# EAGLE design v0.1 (EAGLE 9.2.0)
CNAME: CarIas; CREVISION: C; DESIGNER: OML

## Sheet 1 of 4: MAX31588 thermocouple amp. 7 channels
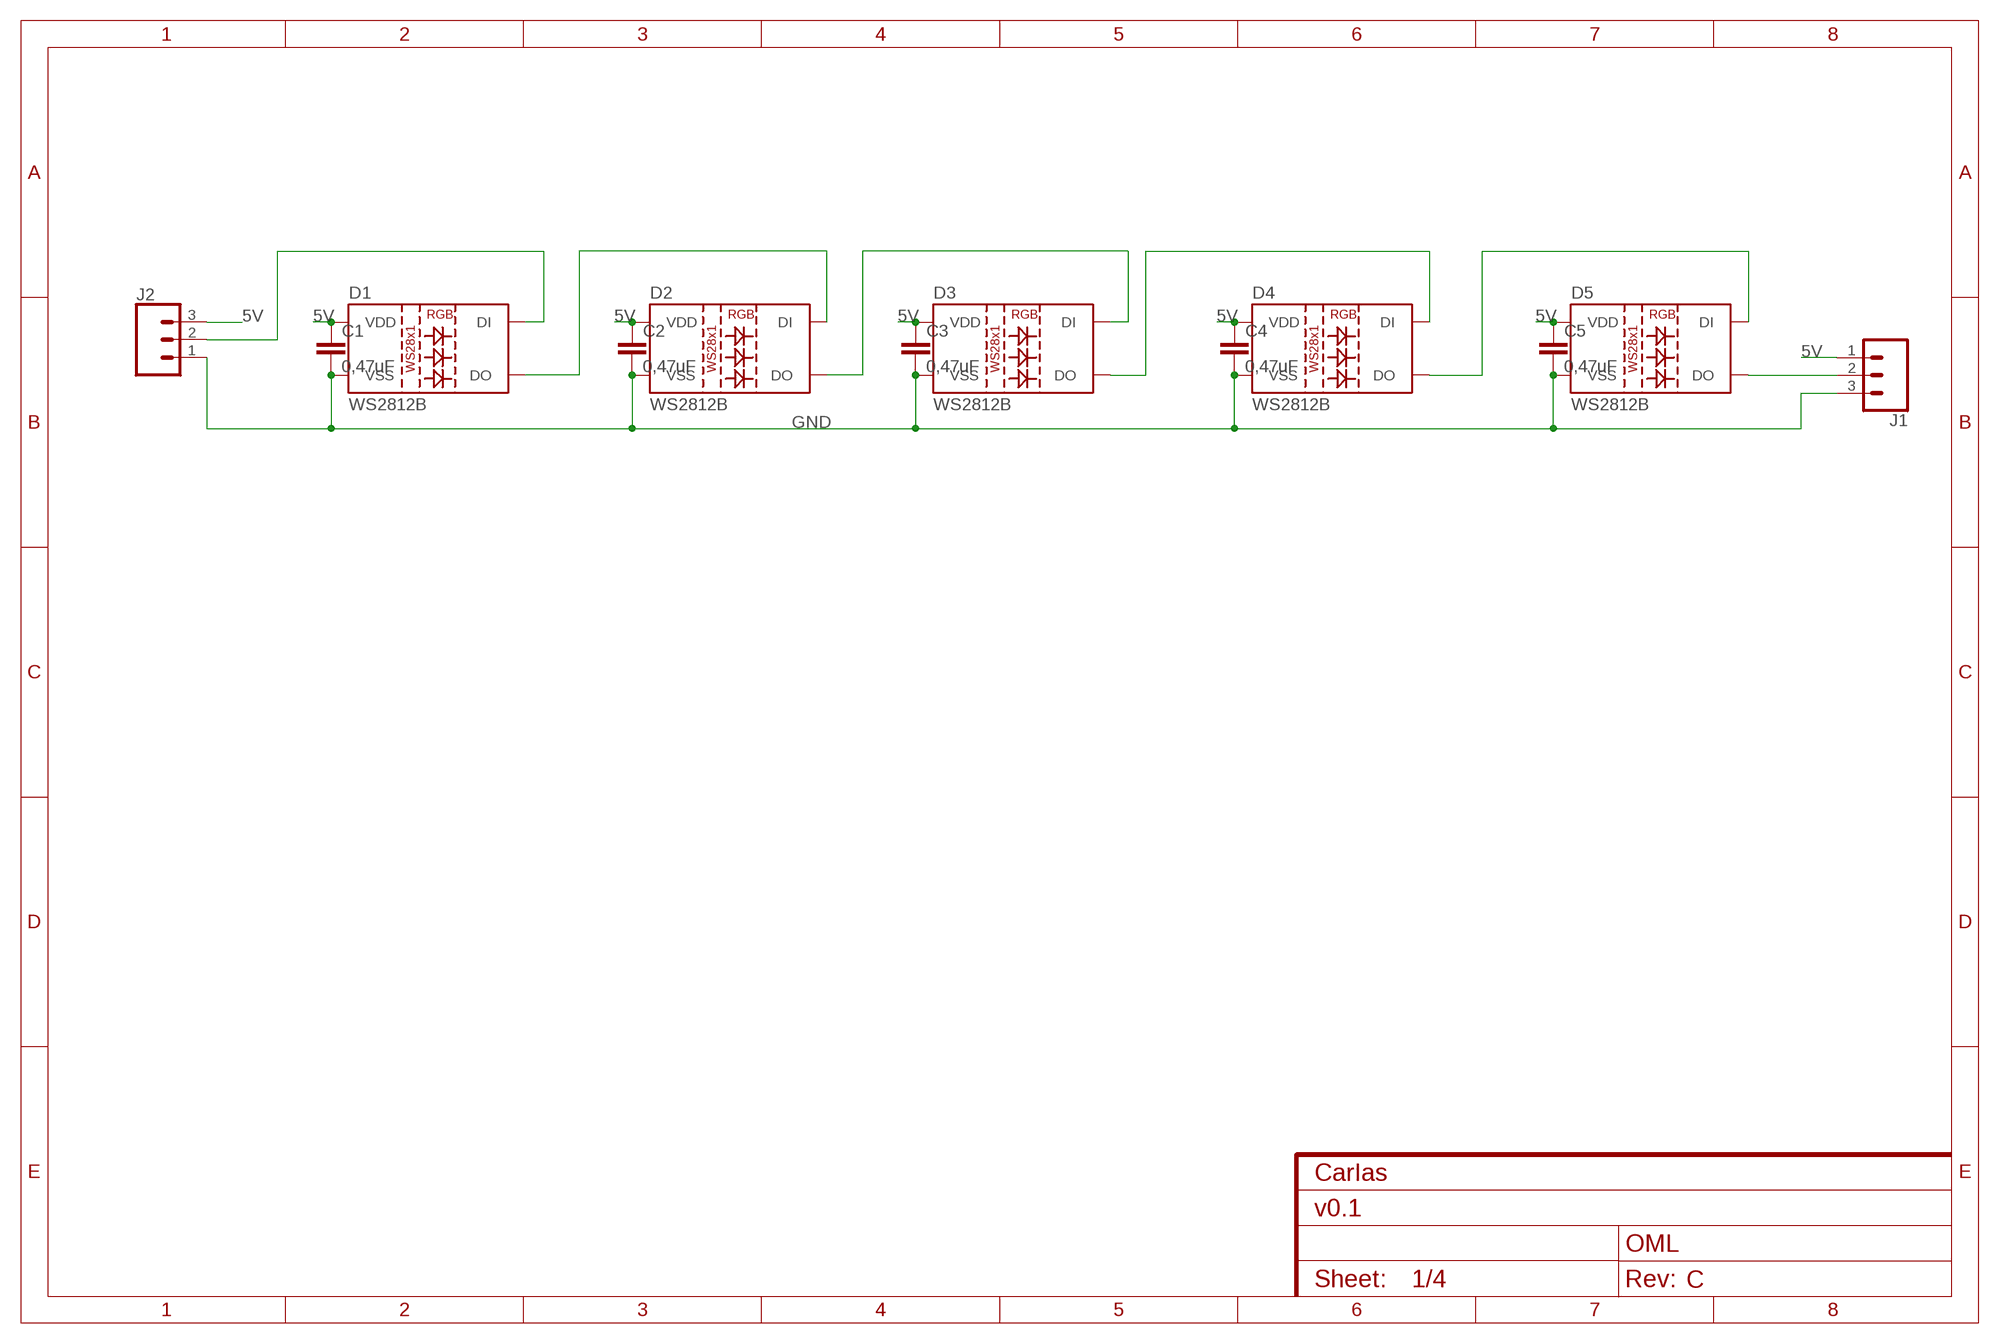
[diagram p0: schematic, sheet 1]

### Parts
C1  0,47uF  1.0UF-1206-50V-10%  [1206]
C2  0,47uF  1.0UF-1206-50V-10%  [1206]
C3  0,47uF  1.0UF-1206-50V-10%  [1206]
C4  0,47uF  1.0UF-1206-50V-10%  [1206]
C5  0,47uF  1.0UF-1206-50V-10%  [1206]
D1  WS2812B  [WS2812B]
D2  WS2812B  [WS2812B]
D3  WS2812B  [WS2812B]
D4  WS2812B  [WS2812B]
D5  WS2812B  [WS2812B]
J1  CONN_03JST-PTH  [JST-3-PTH]
J2  CONN_03JST-PTH  [JST-3-PTH]

### Nets
5V [5v]: C1.1 C2.1 C3.1 C4.1 C5.1 D1.1(VDD) D2.1(VDD) D3.1(VDD) D4.1(VDD) D5.1(VDD) J1.1 J2.3
GND [GND]: C1.2 C2.2 C3.2 C4.2 C5.2 D1.3(VSS) D2.3(VSS) D3.3(VSS) D4.3(VSS) D5.3(VSS) J1.3 J2.1
N$1: D1.2(DO) D2.4(DI)
N$2: D2.2(DO) D3.4(DI)
N$3: D3.2(DO) D4.4(DI)
N$4: D4.2(DO) D5.4(DI)
N$5: D5.2(DO) J1.2
N$7: D1.4(DI) J2.2

## Sheet 2 of 4: USB to Uart converter. Atmel 328 microcontroller
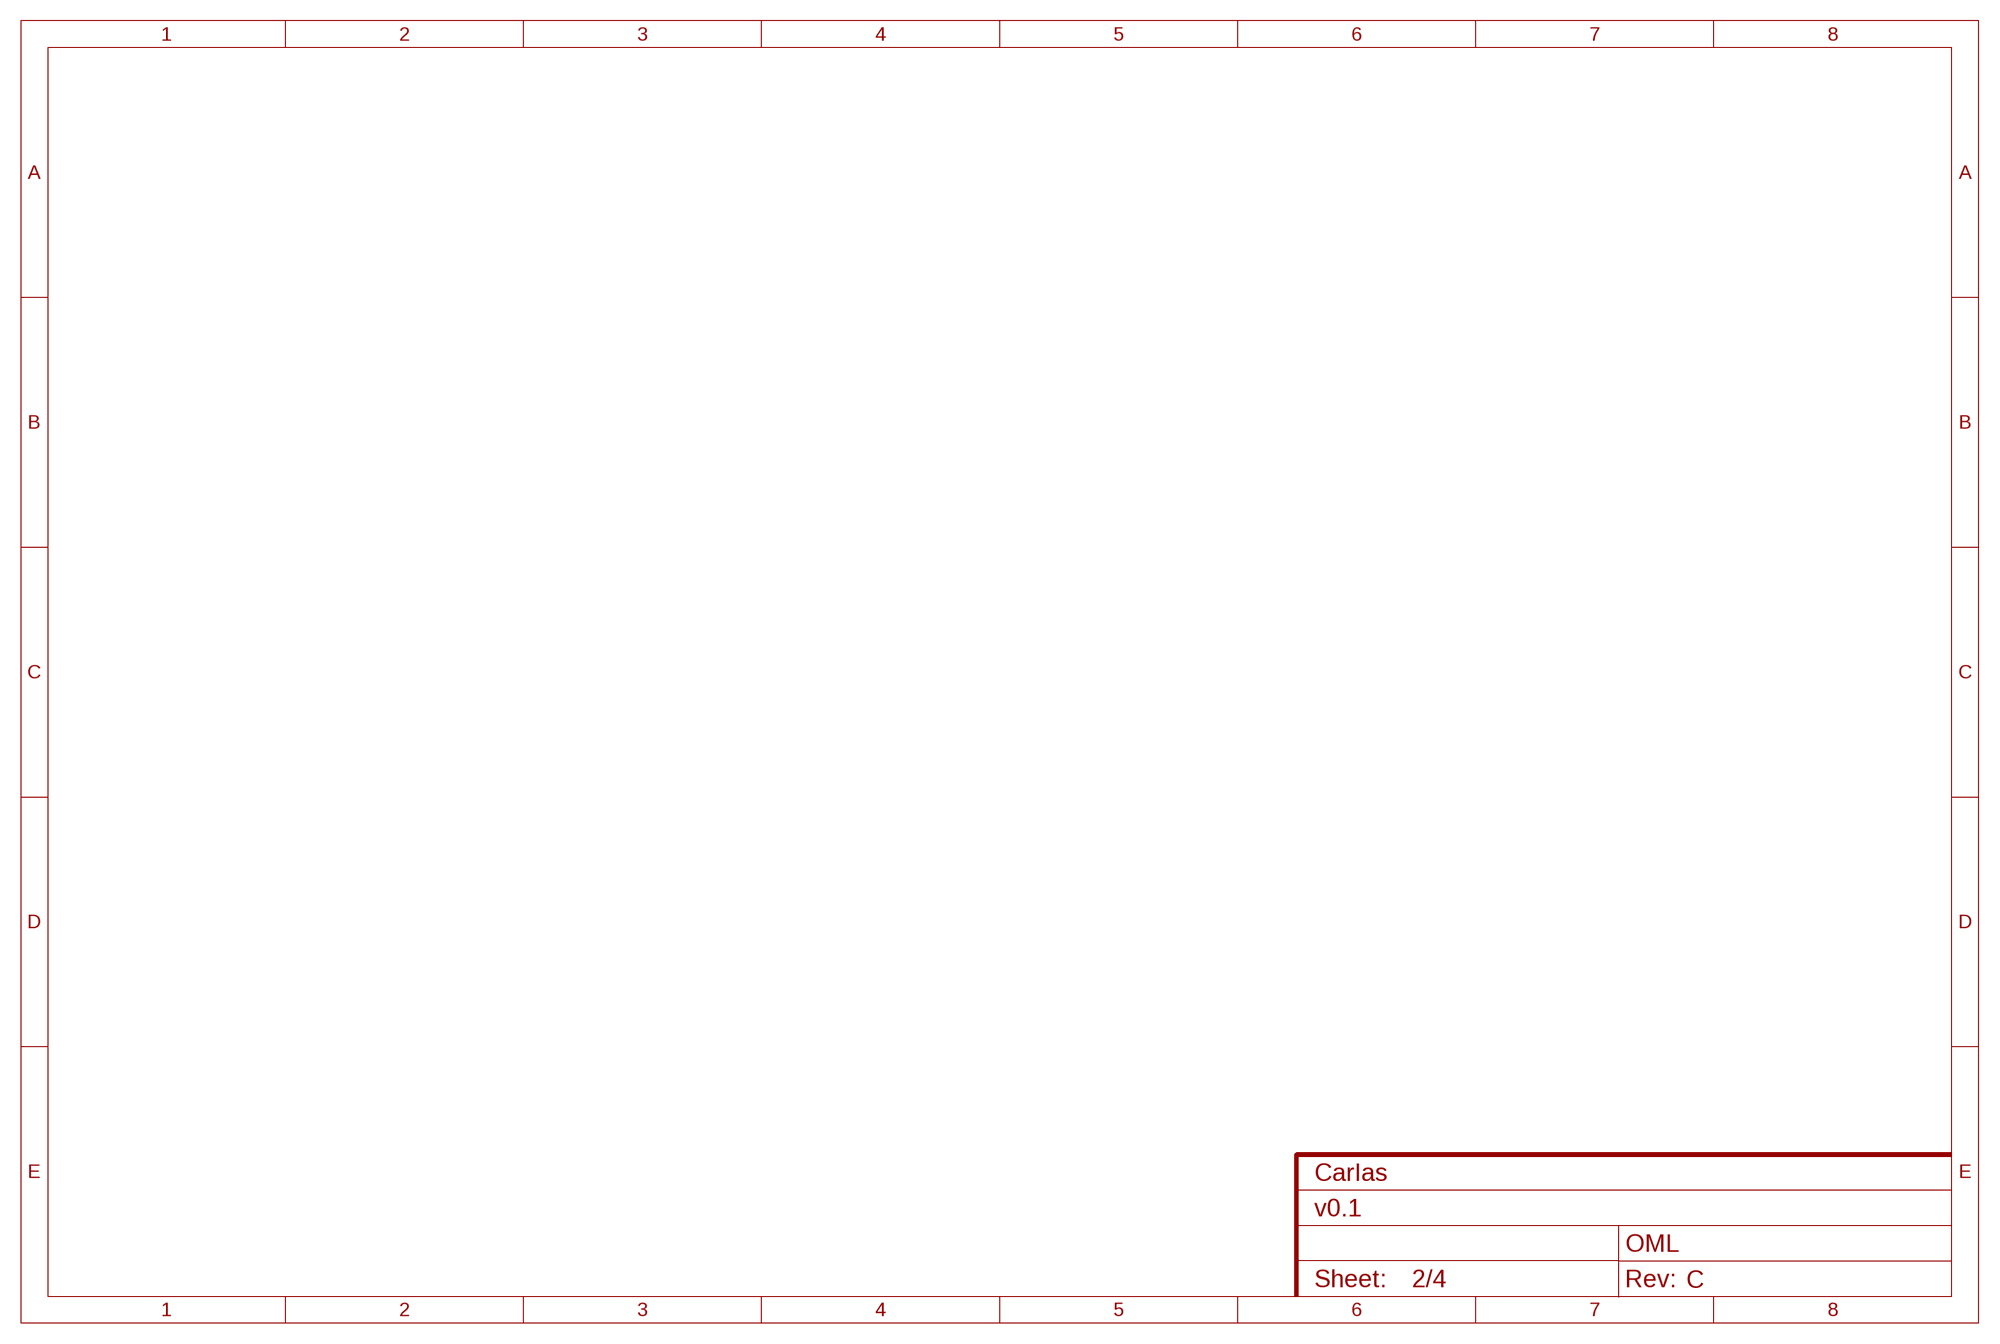
[diagram p1: schematic, sheet 2]

## Sheet 3 of 4: 5v power regulator. Relay circuit.
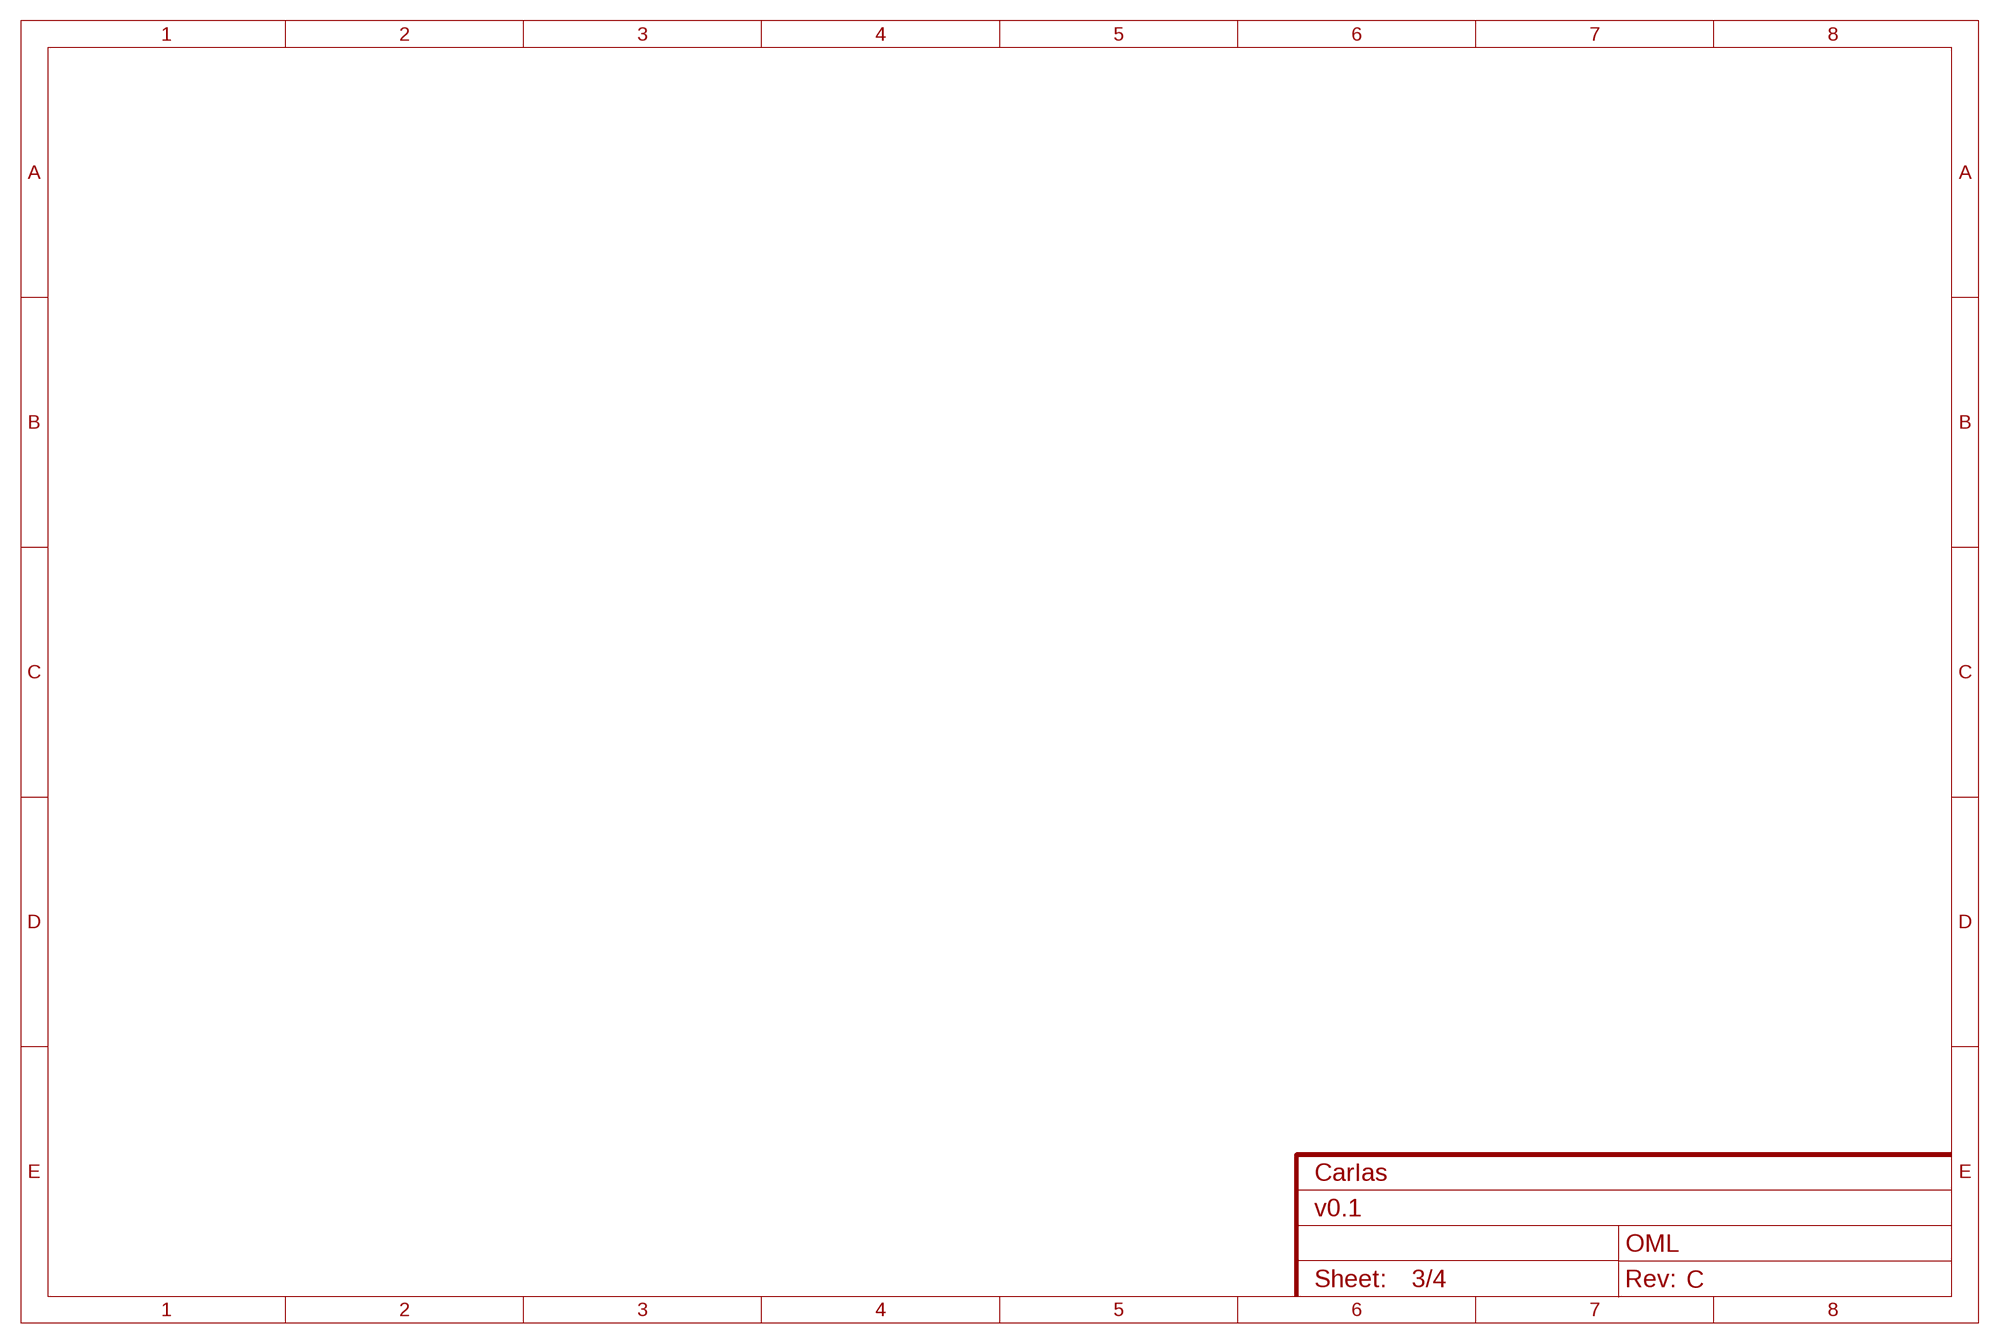
[diagram p2: schematic, sheet 3]

## Sheet 4 of 4
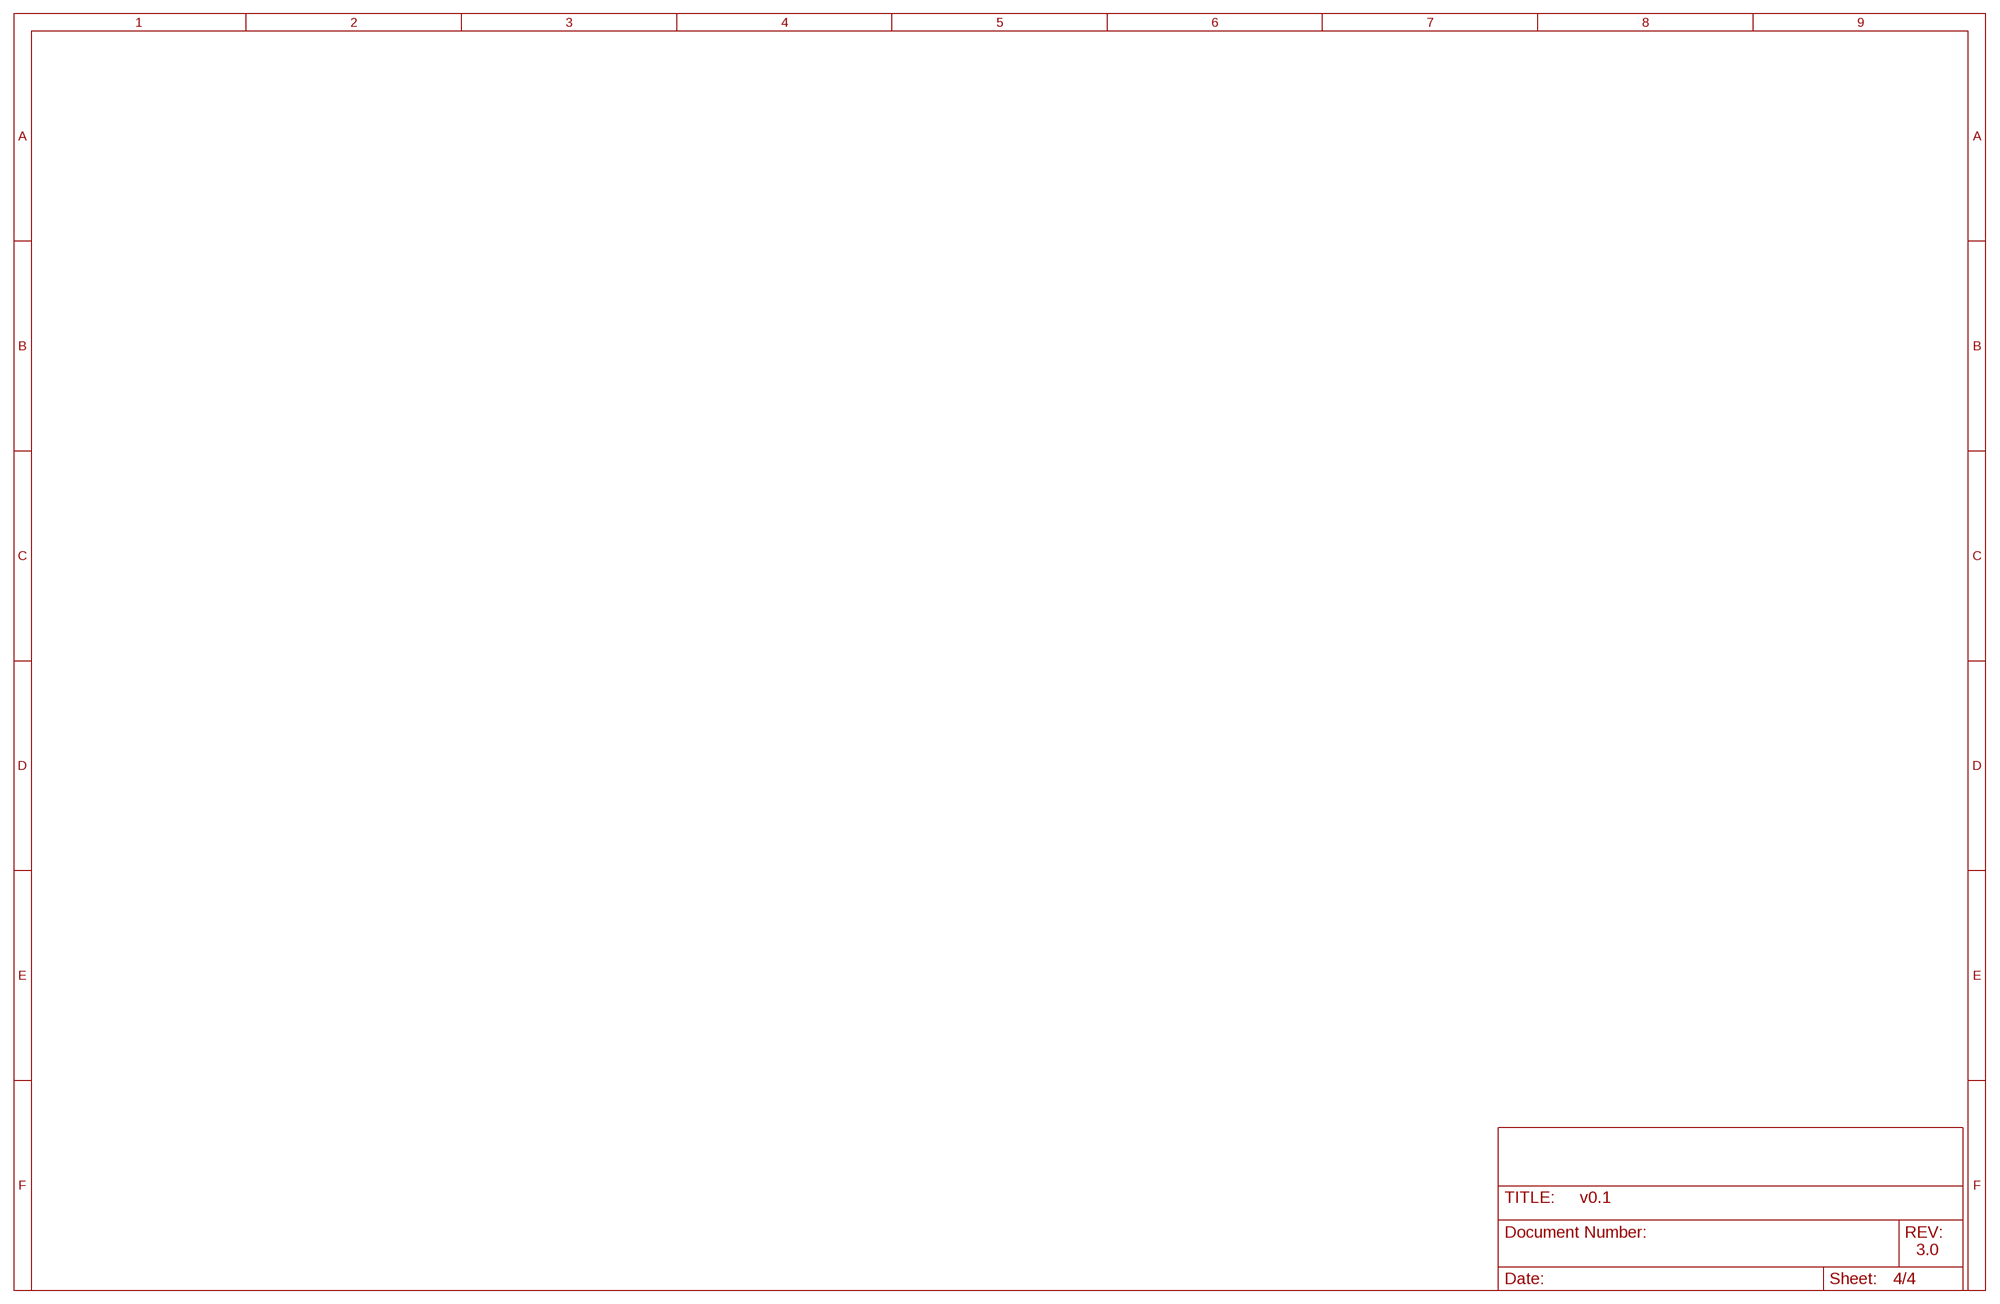
[diagram p3: schematic, sheet 4]

### Notes on the sheet
- 3.0

## Library data of the parts
C1-C5 = SparkFun-Capacitors:1.0UF: 1µF ceramic capacitors A capacitor is a passive two-terminal electrical component used to store electrical energy temporarily in an electric field.; PROD_ID: CAP-09822; VALUE: 1.0uF
D1-D5 = SparkFun-LED:WS2812B: WS2812B SMD addressable RGB LED 5x5mm SMD LED with built-in controller IC. Color: Red/Green/Blue mC Rating: RGB: 390, 660, 180 mcd Forward Voltage: RGB: 2.0, 3.0, 3.0 V Packages:WS2812B SparkFun Products: Blynk Board - ESP8266 <https://www.sparkfun.com/products/13794>; PROD_ID: DIO-12503
J1 J2 = SparkFun-Connectors:CONN_03: Multi connection point. Often used as Generic Header-pin footprint for 0.1 inch spaced/style header connections On any of the 0.1 inch spaced packages, you can populate with these: Break Away Headers - Straight <https://www.sparkfun.com/products/116> (PRT-00116) Break Away Male Headers - Right Angle <https://www.sparkfun.com/products/553> (PRT-00553) Female Headers <https://www.sparkfun.com/products/115> (PRT-00115) Break Away Headers - Machine Pin <https://www.sparkfun.com/products/117> (PRT-00117) Break Away Female Headers - Swiss Machine Pin <https://www.sparkfun.com/products/743> (PRT-00743) Stackable Header - 3 Pin (Female, 0.1") <https://www.sparkfun.com/products/13875> (PRT-13875) For SCREWTERMINALS and SPRING TERMINALS visit here: Screw Terimnals on SparkFun.com <https://www.sparkfun.com/search/results?term=Screw+Terminals> (5mm/3.5mm/2.54mm spacing) This device is also useful as a general connection point to wire up your design to another part of your project. Our various solder wires solder well into these plated through hole pads. Hook-Up Wire - Assortment (Stranded, 22 AWG) <https://www.sparkfun.com/products/11375> (PRT-11375) Hook-Up Wire - Assortment (Solid Core, 22 AWG) <https://www.sparkfun.com/products/11367> (PRT-11367) View the entire wire category on our website here <https://www.sparkfun.com/categories/141> Special notes: Molex polarized connector foot print use with SKU : PRT-08232 with associated crimp pins and housings.; PROD_ID: WIRE-10037; SF_ID: PRT-09915

## Net classes
1 GND: width 1.016 mm
2 5v: width 1.016 mm

## Board
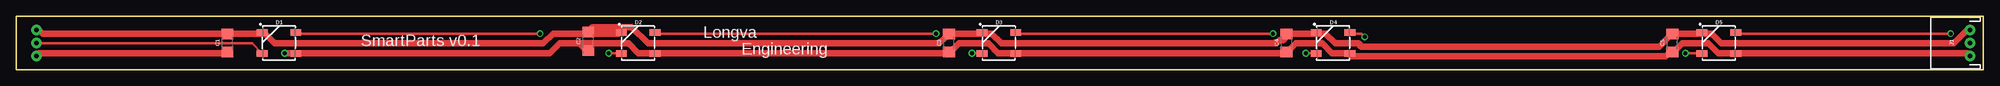
[diagram p4: board, top side]
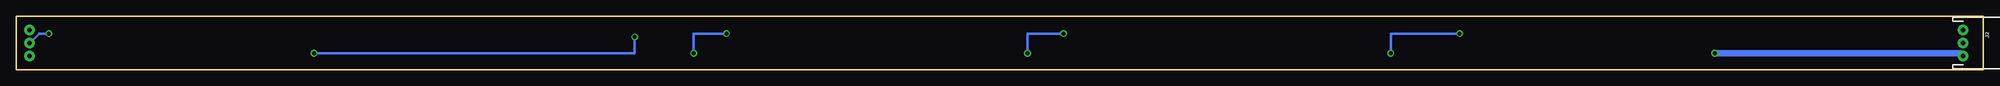
[diagram p5: board, bottom side, seen from below]

Size 300.48 x 8.13 mm. Coordinates in mm from the lower left corner, seen from the top.
Outline: 0,8.13 300.48,8.13 300.48,0 0,0 0,8.13
Copper layers (1*16): Top 0.035mm / dielectric 1.5mm / Bottom 0.035mm
Design rules "default *": minimum track width 16mil, minimum drill 24mil, track to track 8mil, track to pad 7mil, pad to pad 8mil, via to via 8mil, smd to smd 8mil, copper to edge 40mil, drill to drill 8mil, minimum pad ring 10mil, minimum via ring 8mil, stop-mask expansion 4mil, vias tented up to drill 0mil, thermal gap 10mil
Milling: 4 lines

### Footprints (pad centres in the part's own frame; a part is rotated, then mirrored left to right if it is on the bottom)
1206 = smd 1.6 x 1.8: 1 -1.4,0; 2 1.4,0
WS2812B = smd 1.651 x 1: 1 2.577,-1.6; 2 2.577,1.6; 3 -2.577,1.6; 4 -2.577,-1.6
JST-3-PTH = drill 0.7 pad 1.6: 1 -2,0; 2 0,0; 3 2,0

### Placement (x,y rotation side)
C1  32.26,4.06 90 top
C2  87.38,4.32 90 top
C3  142.49,4.06 90 top
C4  194.06,4.06 90 top
C5  252.98,4.06 90 top
D1  40.13,4.06 0 top
D2  95,4.06 0 top
D3  150.11,4.06 0 top
D4  201.17,4.06 0 top
D5  260.1,4.06 0 top
J1  298.45,4.06 90 top
J2  3.05,4.06 270 bottom

### Tracks (layer width: path | path; a pad name or v marks a point on that pad's centre or on a via)
5V  (via drill 0.61)
  Top 1.016: C1.1 32,2.5 3.5,2.5 J2.3 | 86,4 83,4 81.5,2.5 43,2.5 D1.1 42.5,2.5 v41,2.5 | 86,4 87,3 C2.1 | 86,4 93.5,4 95,2.5 97.5,2.5 D2.1 98,2.5 142,2.5 C3.1 142.5,3 143,3 144,4 148.5,4 150,2.5 152.5,2.5 D3.1 153,2.5 194,2.5 C4.1 194.5,3 195.5,4 199.5,4 201,2.5 203.5,2.5 D4.1 204,2 252,2 252.5,2.5 C5.1 253,3 253.5,3 254.5,4 258.5,4 260,2.5 262.5,2.5 D5.1 263,2.5 298,2.5 J1.1
  Bottom 1.016: v41,2.5 3.5,2.5 J2.3
GND
  Top 1.016: D2.3 92,5.5 87.5,5.5 C2.2 | J2.1 3.5,6 4,5.5 32,5.5 C1.2 32.5,5.5 37.5,5.5 D1.3 38,5.5 39.5,4 80.5,4 82,5.5 87,5.5 C2.2 | J1.3 298,6 296,4 260.5,4 259,5.5 258,5.5 D5.3 257.5,5.5 253,5.5 C5.2 252.5,5 251,3.5 205.5,3.5 205,4 201.5,4 200,5.5 199,5.5 D4.3 198.5,5.5 194.5,5.5 C4.2 194,5 193.5,4.5 193,4.5 192.5,4 150.5,4 149,5.5 148,5.5 D3.3 147.5,5.5 142.5,5.5 C3.2 142,5 141,4 96.5,4 94,6.5 88,6.5 87.5,6 C2.2
N$1  (via drill 0.61)
  Top 0.406: v80,5.5 43,5.5 D1.2 | v90.5,2.5 92,2.5 D2.4
  Bottom 0.406: v80,5.5 90.5,5.5 v90.5,2.5
N$2  (via drill 0.61)
  Top 0.406: v140.5,5.5 98,5.5 D2.2 | v146,2.5 147.5,2.5 D3.4
  Bottom 0.406: v140.5,5.5 146,5.5 v146,2.5
N$3  (via drill 0.61)
  Top 0.406: v192,5.5 153,5.5 D3.2 | v197,2.5 198.5,2.5 D4.4
  Bottom 0.406: v192,5.5 197,5.5 v197,2.5
N$4  (via drill 0.61)
  Top 0.406: v255,2.5 257.5,2.5 D5.4 | v206,5 205.5,5.5 204,5.5 D4.2
  Bottom 0.406: v255,2.5 206,2.5 v206,5
N$5  (via drill 0.61)
  Top 0.406: v295.5,5.5 263,5.5 D5.2
  Bottom 0.406: v295.5,5.5 297,5.5 298,4.5 J1.2
N$7
  Top 0.406: D1.4 37.5,2.5 36,4 3.5,4 J2.2

### Text on the board
tNames: Longva | SmartParts v0.1 | Engineering